# EAGLE design Obstacle+Bluetooth V1.0 (EAGLE 7.7.0)
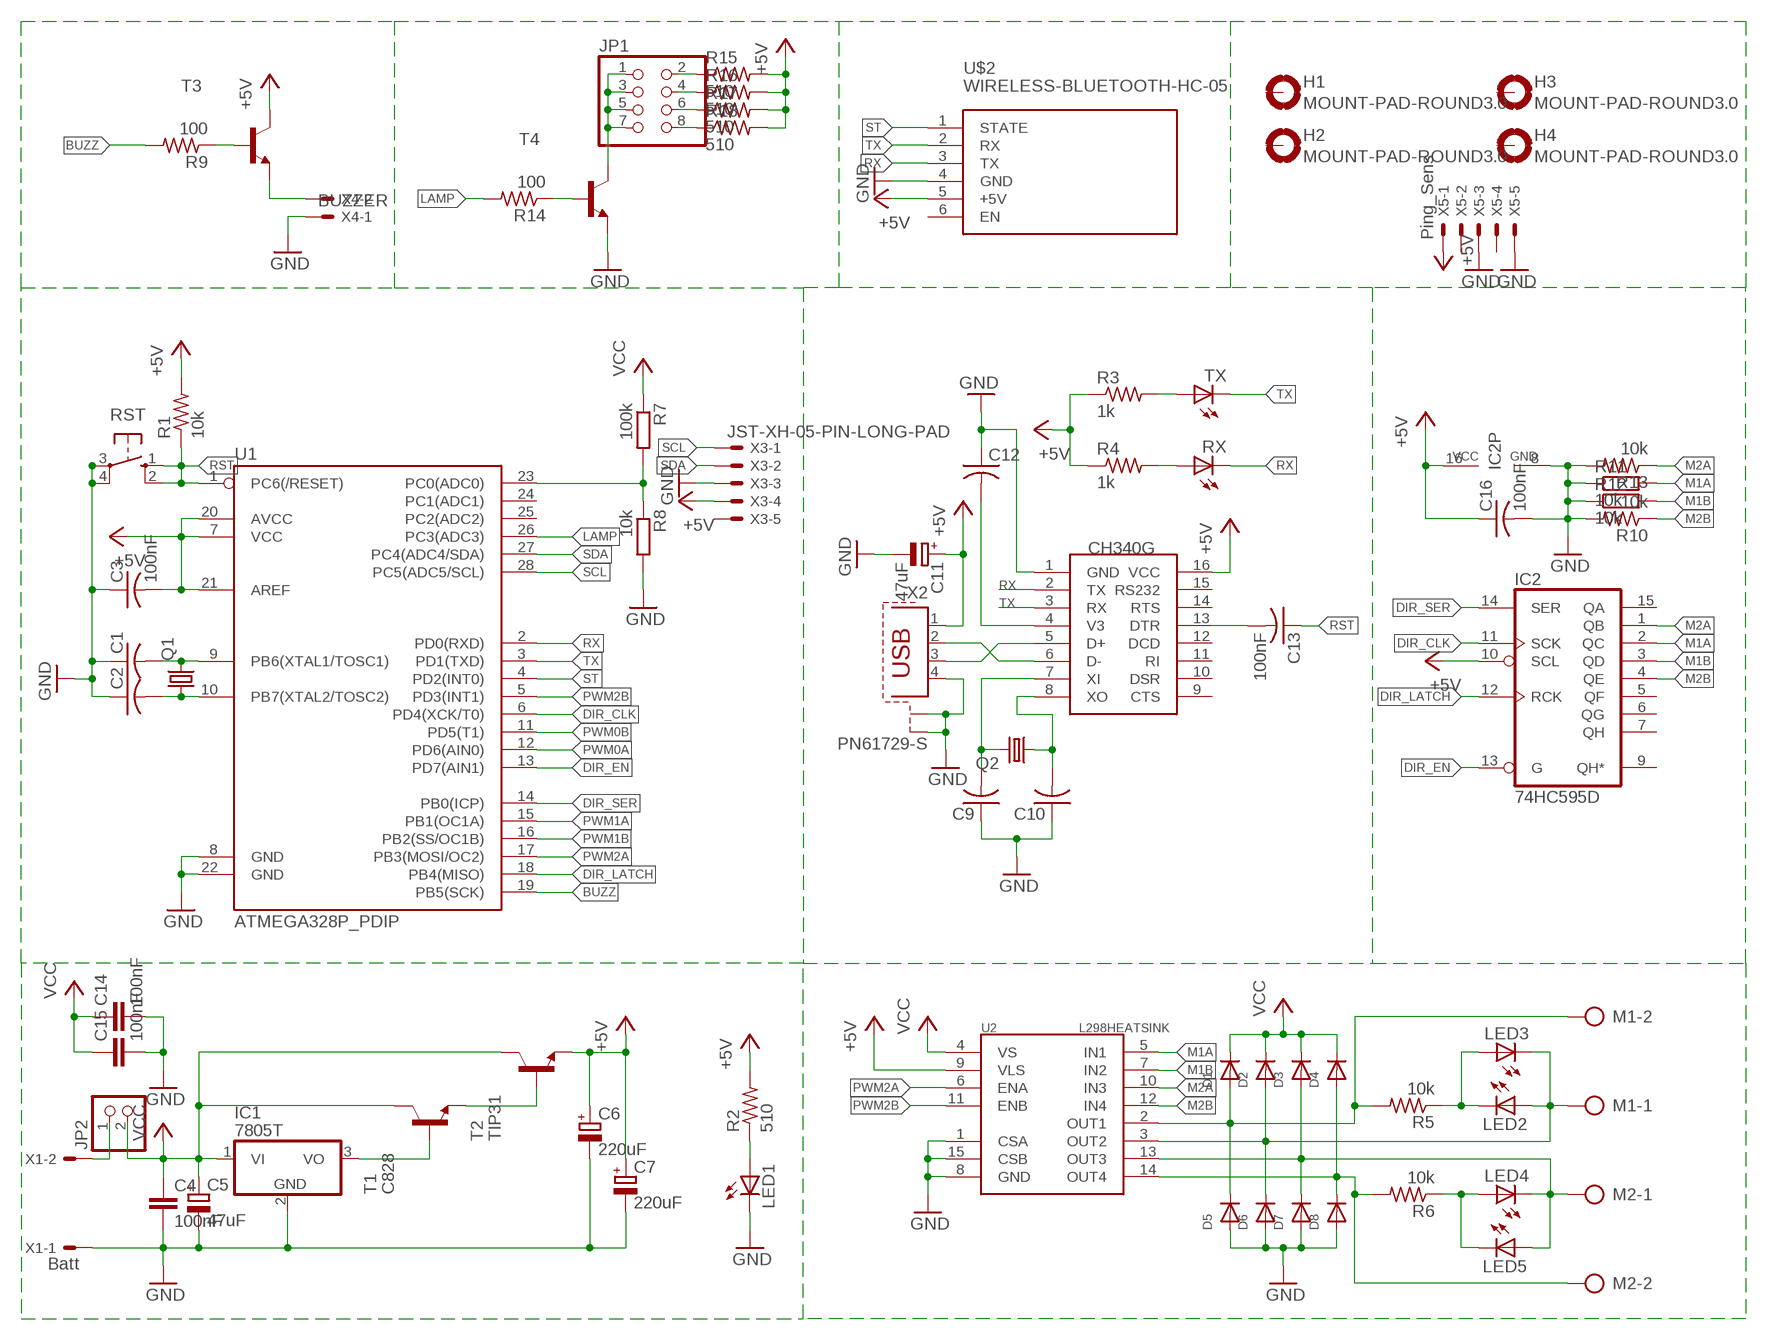
[diagram p0: schematic, sheet 1]

## Parts
C1  C-USC0603K  [C0603K]
C2  C-USC0603K  [C0603K]
C3  100nF  C-USC0603K  [C0603K]
C4  100nF  C5/2.5  [C5B2.5]
C5  47uF  CPOL-EUE2.5-7  [E2,5-7]
C6  220uF  CPOL-EUE2.5-5  [E2,5-5]
C7  220uF  CPOL-EUE2.5-5  [E2,5-5]
C9  C-USC0603K  [C0603K]
C10  C-USC0603K  [C0603K]
C11  47uF  CPOL-EUE2.5-7  [E2,5-7]
C12  C-USC0603K  [C0603K]
C13  100nF  C-USC0603K  [C0603K]
C14  100nF  C5/2.5  [C5B2.5]
C15  100nF  C5/2.5  [C5B2.5]
C16  100nF  C-USC0603K  [C0603K]
D1  DIODESMA  [SMADIODE]
D2  DIODESMA  [SMADIODE]
D3  DIODESMA  [SMADIODE]
D4  DIODESMA  [SMADIODE]
D5  DIODESMA  [SMADIODE]
D6  DIODESMA  [SMADIODE]
D7  DIODESMA  [SMADIODE]
D8  DIODESMA  [SMADIODE]
H1  MOUNT-PAD-ROUND3.0  [3,0-PAD]
H2  MOUNT-PAD-ROUND3.0  [3,0-PAD]
H3  MOUNT-PAD-ROUND3.0  [3,0-PAD]
H4  MOUNT-PAD-ROUND3.0  [3,0-PAD]
IC1  7805T  [TO220H]
IC2  74HC595D  [SO16]
JP1  PINHD-2X4  [2X04]
JP2  PINHD-1X2  [1X02]
LED1  LED3MM  [LED3MM]
LED2  LED3MM  [LED3MM]
LED3  LED3MM  [LED3MM]
LED4  LED3MM  [LED3MM]
LED5  LED3MM  [LED3MM]
M1  AK500/2  [AK500/2]
M2  AK500/2  [AK500/2]
Q1  CRYSTALHC49U-V  [HC49U-V]
Q2  CRYSTALHC49U-V  [HC49U-V]
R1  10k  R-US_R0603  [R0603]
R2  510  R-US_R0603  [R0603]
R3  1k  R-US_R0603  [R0603]
R4  1k  R-US_R0603  [R0603]
R5  10k  R-US_R0603  [R0603]
R6  10k  R-US_R0603  [R0603]
R7  100k  R-EU_0207/7  [0207/7]
R8  10k  R-EU_0207/7  [0207/7]
R9  100  R-US_R0603  [R0603]
R10  10k  R-US_R0603  [R0603]
R11  10k  R-EU_0207/7  [0207/7]
R12  10k  R-EU_0207/7  [0207/7]
R13  10k  R-US_R0603  [R0603]
R14  100  R-US_R0603  [R0603]
R15  510  R-US_R0603  [R0603]
R16  510  R-US_R0603  [R0603]
R17  510  R-US_R0603  [R0603]
R18  510  R-US_R0603  [R0603]
RST  10-XX  [B3F-10XX]
RX  LED3MM  [LED3MM]
T1  C828  2SC945  [TO92-ECB]
T2  TIP31  [TO220]
T3  -NPN-TO92L  [TO92L]
T4  -NPN-TO92L  [TO92L]
TX  LED3MM  [LED3MM]
U1  ATMEGA328P_PDIP  [DIL28-3]
U2  L298HEATSINK  [MULTIWATT15_6400BGHEATSINK]
U$1  CH340G  [SOIC16]
U$2  WIRELESS-BLUETOOTH-HC-05  [WIRELESS-BLUETOOTH-HC-05]
X1  Batt  JST-XH-02-PIN-LONG-PAD  [JST-XH-02-PACKAGE-LONG-PAD]
X2  PN61729-S  [PN61729-S]
X3  JST-XH-05-PIN-LONG-PAD  [JST-XH-05-PACKAGE-LONG-PAD]
X4  BUZZER  JST-XH-02-PIN-LONG-PAD  [JST-XH-02-PACKAGE-LONG-PAD]
X5  Ping_Sens  JST-XH-05-PIN-LONG-PAD  [JST-XH-05-PACKAGE-LONG-PAD]

## Nets
+5V: C3.2 C6.+ C7.+ C11.+ C16.1 IC2.10(SCL) IC2.16(VCC) R1.2 R2.2 R3.1 R4.1 R15.2 R16.2 R17.2 R18.2 T2.3(E) T3.3(C) U1.7(VCC) U1.20(AVCC) U1.21(AREF) U2.9(VLS) U$1.16(VCC) U$2.5(+5V) X2.1 X3.4 X5.1
BUZZ: R9.2 U1.19(PB5(SCK))
DIR_CLK: IC2.11(SCK) U1.6(PD4(XCK/T0))
DIR_EN: IC2.13(G) U1.13(PD7(AIN1))
DIR_LATCH: IC2.12(RCK) U1.18(PB4(MISO))
DIR_SER: IC2.14(SER) U1.14(PB0(ICP))
GND: C1.1 C2.1 C3.1 C4.2 C5.- C6.- C7.- C9.1 C10.1 C11.- C12.1 C14.2 C15.2 C16.2 D5.A D6.A D7.A D8.A IC1.2(GND) IC2.8(GND) LED1.K(C) R8.2 R10.2 R11.1 R12.1 R13.2 RST.3(P) RST.4(P1) T4.1(E) U1.8(GND) U1.22(GND) U2.1(CSA) U2.8(GND) U2.15(CSB) U$1.1(GND) U$2.4(GND) X1.1 X2.4 X2.S1 X2.S2 X3.3 X4.1 X5.3 X5.5
LAMP: R14.2 U1.26(PC3(ADC3))
M1A: IC2.2(QC) R11.2 U2.5(IN1)
M1B: IC2.3(QD) R12.2 U2.7(IN2)
M2A: IC2.1(QB) R13.1 U2.10(IN3)
M2B: IC2.4(QE) R10.1 U2.12(IN4)
N$1: C1.2 Q1.2 U1.9(PB6(XTAL1/TOSC1))
N$2: C2.2 Q1.1 U1.10(PB7(XTAL2/TOSC2))
N$3: C13.2 U$1.13(DTR)
N$5: R4.2 RX.A
N$6: IC1.3(VO) T1.B
N$7: T1.E T2.1(B)
N$8: R3.2 TX.A
N$9: LED1.A R2.1
N$11: U$1.6(D-) X2.2
N$12: U$1.5(D+) X2.3
N$13: C9.2 Q2.2 U$1.7(XI)
N$14: C10.2 Q2.1 U$1.8(XO)
N$15: D2.A D6.C LED2.A LED3.K(C) M1.1 U2.3(OUT2)
N$16: D3.A D7.C LED4.K(C) LED5.A M2.1 U2.13(OUT3)
N$17: C12.2 U$1.4(V3)
N$18: D4.A D8.C M2.2 R6.2 U2.14(OUT4)
N$19: LED2.K(C) LED3.A R5.1
N$20: LED4.A LED5.K(C) R6.1
N$21: R7.2 R8.1 U1.23(PC0(ADC0))
N$22: T3.1(E) X4.2
N$23: R9.1 T3.2(B)
N$24: R14.1 T4.2(B)
N$27: JP2.1 X1.2
N$28: JP1.1 JP1.3 JP1.5 JP1.7 T4.3(C)
N$29: JP1.2 R15.1
N$30: JP1.4 R16.1
N$31: JP1.6 R17.1
N$32: JP1.8 R18.1
N$34: D1.A D5.C M1.2 R5.2 U2.2(OUT1)
PWM0A: U1.12(PD6(AIN0))
PWM0B: U1.11(PD5(T1))
PWM1A: U1.15(PB1(OC1A))
PWM1B: U1.16(PB2(SS/OC1B))
PWM2A: U1.17(PB3(MOSI/OC2)) U2.6(ENA)
PWM2B: U1.5(PD3(INT1)) U2.11(ENB)
RST: C13.1 R1.1 RST.1(S) RST.2(S1) U1.1(PC6(/RESET))
RX: RX.K(C) U1.2(PD0(RXD)) U$1.2(TX) U$2.3(TX)
SCL: U1.28(PC5(ADC5/SCL)) X3.1
SDA: U1.27(PC4(ADC4/SDA)) X3.2
ST: U1.4(PD2(INT0)) U$2.1(STATE)
TX: TX.K(C) U1.3(PD1(TXD)) U$1.3(RX) U$2.2(RX)
VCC: C4.1 C5.+ C14.1 C15.1 D1.C D2.C D3.C D4.C IC1.1(VI) JP2.2 R7.1 T1.C T2.2(C) U2.4(VS)
Unconnected: H1.B3,0(MOUNT) H2.B3,0(MOUNT) H3.B3,0(MOUNT) H4.B3,0(MOUNT) IC2.5(QF) IC2.6(QG) IC2.7(QH) IC2.9(QH*) IC2.15(QA) U1.24(PC1(ADC1)) U1.25(PC2(ADC2)) U$1.9(CTS) U$1.10(DSR) U$1.11(RI) U$1.12(DCD) U$1.14(RTS) U$1.15(RS232) U$2.6(EN) X3.5 X5.2 X5.4

## Library data of the parts
C1-C3 C9 C10 C12 C13 C16 = CircuitBean:C-US: CAPACITOR, American symbol
C4 C14 C15 = capacitor-wima:C: CAPACITOR naming: grid - package width
C5-C7 C11 = resistor:CPOL-EU: POLARIZED CAPACITOR, European symbol
D1-D8 = CircuitBean:DIODE: Diode SMADIODE - SMA Surface Mount Package 20V 1A Schottky Diode Digikey: 641-1014-6-ND DO-1N4148 - Through Hole Small Current Diode SOD-123 20V 1 A (.5mV Vf) Schottky Diode - Digikey: MBRX120TPMSCT-ND SOD-323 10V 570mA (.38mV Vf, 3ns) Schottky Diode - Digikey: ZLLS410CT-ND SOD-523 30V 30mA Schottky Diode (RB751S-40TE61) - Digikey: RB751S-40TE61CT-ND SOT23-R/W - SOT23 Package (R = Solder Paste/Reflow Ovens, W = Hand-Soldering) BAT54Film 40V 300mA - Digikey: 497-7162-1-ND
H1-H4 = holes:MOUNT-PAD-ROUND: MOUNTING PAD, round
IC1 = linear:78*: Positive VOLTAGE REGULATOR Source: http://cache.national.com/ds/LM/LM78L05.pdf http://www.fairchildsemi.com/ds/LM/LM7805.pdf
IC2 = 74xx-eu:74*595: 8-bit SHIFT REGISTER, output latch
JP1 = pinhead:PINHD-2X4: PIN HEADER
JP2 = pinhead:PINHD-1X2: PIN HEADER
LED1-LED5 RX TX = CircuitBean:LED: LED OSRAM: - CHIPLED LG R971, LG N971, LY N971, LG Q971, LY Q971, LO R971, LY R971 LH N974, LH R974 LS Q976, LO Q976, LY Q976 LO Q996 - Hyper CHIPLED LW Q18S LB Q993, LB Q99A, LB R99A - SideLED LS A670, LO A670, LY A670, LG A670, LP A670 LB A673, LV A673, LT A673, LW A673 LH A674 LY A675 LS A676, LA A676, LO A676, LY A676, LW A676 LS A679, LY A679, LG A679 - Hyper Micro SIDELED® LS Y876, LA Y876, LO Y876, LY Y876 LT Y87S - SmartLED LW L88C, LW L88S LB L89C, LB L89S, LG L890 LS L89K, LO L89K, LY L89K LS L896, LA L896, LO L896, LY L896 - TOPLED LS T670, LO T670, LY T670, LG T670, LP T670 LSG T670, LSP T670, LSY T670, LOP T670, LYG T670 LG T671, LOG T671, LSG T671 LB T673, LV T673, LT T673, LW T673 LH T674 LS T676, LA T676, LO T676, LY T676, LB T676, LH T676, LSB T676, LW T676 LB T67C, LV T67C, LT T67C, LS T67K, LO T67K, LY T67K, LW E67C LS E67B, LA E67B, LO E67B, LY E67B, LB E67C, LV E67C, LT E67C LW T67C LS T679, LY T679, LG T679 LS T770, LO T770, LY T770, LG T770, LP T770 LB T773, LV T773, LT T773, LW T773 LH T774 LS E675, LA E675, LY E675, LS T675 LS T776, LA T776, LO T776, LY T776, LB T776 LHGB T686 LT T68C, LB T68C - Hyper Mini TOPLED® LB M676 - Mini TOPLED Santana® LG M470 LS M47K, LO M47K, LY M47K Source: http://www.osram.convergy.de/
M1 M2 = con-ptr500:AK500/2: CONNECTOR; OC_FARNELL: unknown; OC_NEWARK: unknown
Q1 Q2 = CircuitBean:CRYSTAL: CRYSTAL; OC_FARNELL: 1666969; OC_NEWARK: unknown
R1-R6 R9 R10 R13-R18 = CircuitBean:R-US_: RESISTOR, American symbol
R7 R8 R11 R12 = resistor:R-EU_: RESISTOR, European symbol
RST = switch-omron:10-XX: OMRON SWITCH; MPN: B3F-1000; OC_FARNELL: 176432; OC_NEWARK: 36M3542
T1 = transistor:2SC945: NPN Silicon Epitaxial Planar Transistor Source: SEMTECH ELECTRONICS LTD. ... 2SC945 2.pdf
T2 = transistor:TIP31: NPN Transistor Medium Power Linear Switching Applications Source: http://onsemi.com
T3 T4 = transistor:*-NPN-: NPN Transistror BF959 corrected 2008.03.06
U1 = SparkFun-DigitalIC:ATMEGA328P_PDIP: uC used in the Arduino 32kb flash, 1k EEPROM, 2k SRAM This is the through-hole version of this chip.
U2 = SparkFun-PowerIC:L298: L298 Dual Full Bridge Driver
U$1 = ch340g:CH340G
U$2 = diy-modules:WIRELESS-BLUETOOTH-HC-05: Bluetooth Transceiver Module based on HC-05 board Tutorial is available here: https://arduino-info.wikispaces.com/BlueTooth-HC05-HC06-Modules-How-To Click here to find device on ebay.com <http://www.ebay.com/sch/hc-05+module+rs232>
X1 X4 = JST XH Connectors v1-0:JST-XH-02-PIN: JST XH Connector 2 Pin Wire to board connector. Pitch: 2,54 mm, (0.100") Number of pins: 2 Created by Rembrandt Electronics www.rembrandtelectronics.com
X2 = con-berg:PN61729-S: BERG USB connector; OC_FARNELL: unknown; OC_NEWARK: unknown
X3 X5 = JST XH Connectors v1-0:JST-XH-05-PIN: JST XH Connector 2 Pin Wire to board connector. Pitch: 2,54 mm, (0.100") Number of pins: 5 Created by Rembrandt Electronics www.rembrandtelectronics.com

## Board
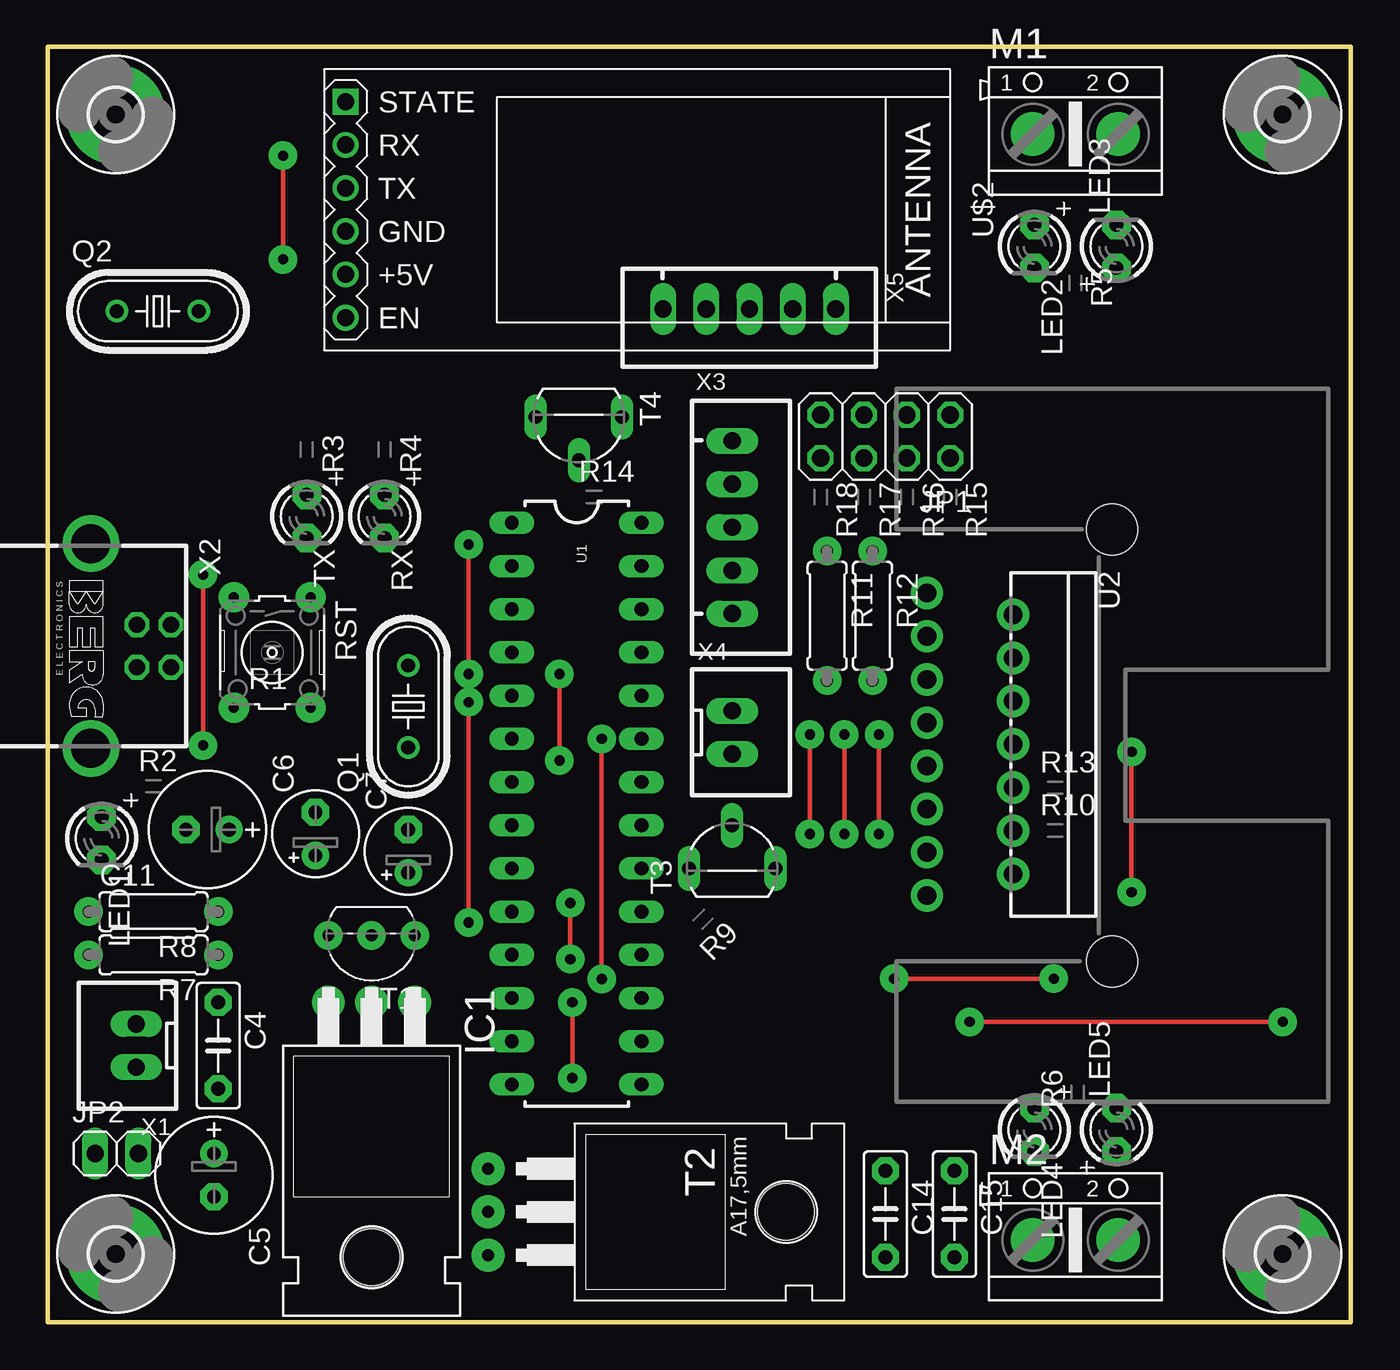
[diagram p1: board, top side]
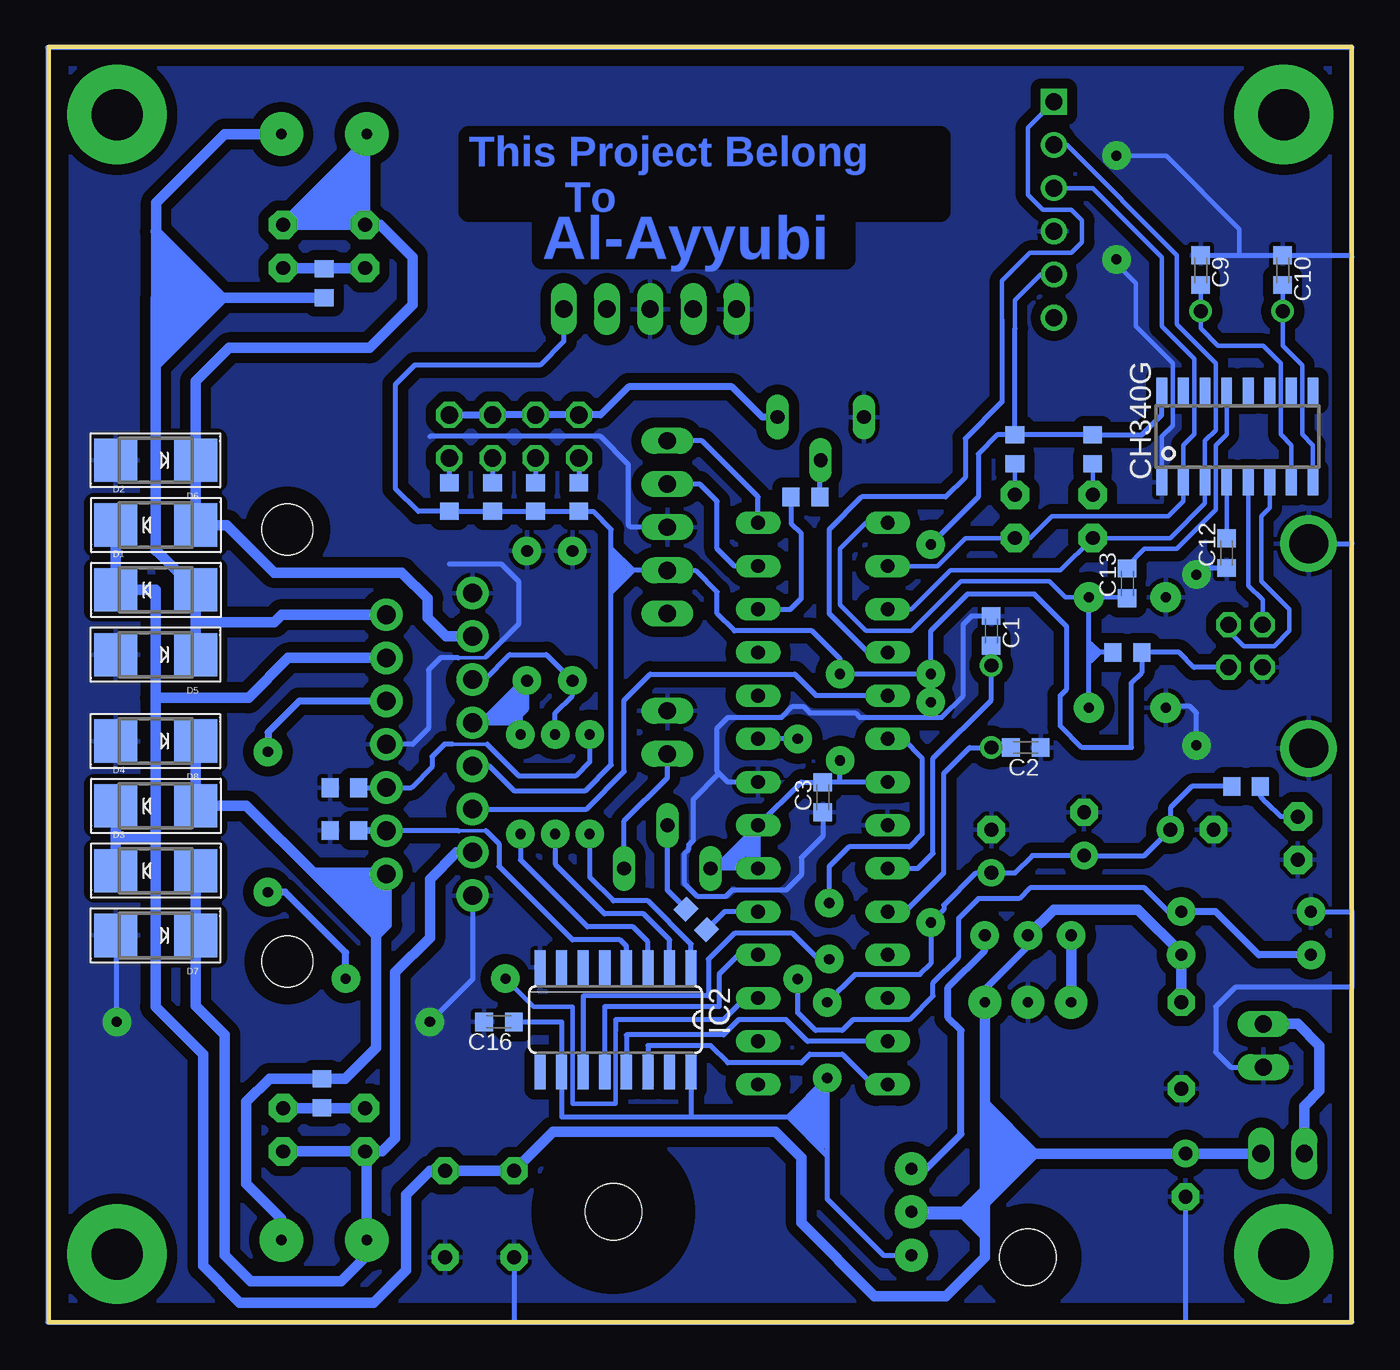
[diagram p2: board, bottom side, seen from below]

Size 76.63 x 75 mm. Coordinates in mm from the lower left corner, seen from the top.
Outline: 0,0 0,75 76.63,75 76.63,0 0,0
Copper layers (1*16): Top 0.035mm / dielectric 1.5mm / Bottom 0.035mm
Design rules "default": minimum track width 10mil, minimum drill 24mil, track to track 8mil, track to pad 8mil, pad to pad 8mil, via to via 8mil, smd to smd 8mil, copper to edge 40mil, drill to drill 8mil, minimum pad ring 10mil, minimum via ring 8mil, stop-mask expansion 4mil, vias tented up to drill 0mil, thermal gap 10mil

### Footprints (pad centres in the part's own frame; a part is rotated, then mirrored left to right if it is on the bottom)
C0603K = smd 1.05 x 1.08: 1 -0.875,0; 2 0.875,0
C5B2.5 = drill 0.813 pad 1.6 octagon: 1 -2.54,0; 2 2.54,0
E2,5-7 = drill 0.813 pad 1.6: + -1.27,0 | drill 0.813 pad 1.6 octagon: - 1.27,0
E2,5-5 = drill 0.813 pad 1.6: + -1.27,0 | drill 0.813 pad 1.6 octagon: - 1.27,0
SMADIODE = smd 2.54 x 2.54: A 2.349,0; C -2.349,0
3,0-PAD = drill 3 pad 5.842: B3,0 0,0
TO220H = drill 0.6 pad 1.93: 1 -2.54,-10.16; 2 0,-10.16; 3 2.54,-10.16 | hole 3.302: 0,4.826
SO16 = smd 0.66 x 2.032: 1 -4.445,-3.073; 2 -3.175,-3.073; 3 -1.905,-3.073; 4 -0.635,-3.073; 5 0.635,-3.073; 6 1.905,-3.073; 7 3.175,-3.073; 8 4.445,-3.073; 9 4.445,3.073; 10 3.175,3.073; 11 1.905,3.073; 12 0.635,3.073; 13 -0.635,3.073; 14 -1.905,3.073; 15 -3.175,3.073; 16 -4.445,3.073
2X04 = drill 1.016 octagon: 1 -3.81,-1.27; 2 -3.81,1.27; 3 -1.27,-1.27; 4 -1.27,1.27; 5 1.27,-1.27; 6 1.27,1.27; 7 3.81,-1.27; 8 3.81,1.27
1X02 = drill 1.016 long: 1 -1.27,0; 2 1.27,0
LED3MM = drill 0.813 pad 1.676 octagon: A -1.27,0; K 1.27,0
AK500/2 = drill 0.6 pad 2.54: 1 -2.515,0; 2 2.515,0
HC49U-V = drill 0.813: 1 -2.413,0; 2 2.413,0
R0603 = smd 1 x 1.1 bottom: 1 -0.85,0; 2 0.85,0
0207/7 = drill 0.7 pad 1.676: 1 -3.81,0; 2 3.81,0
B3F-10XX = drill 0.6 pad 1.778: 1 -3.251,2.261; 2 3.251,2.261; 3 -3.251,-2.261; 4 3.251,-2.261
TO92-ECB = drill 0.7 pad 1.676: B 2.54,0; C 0,0; E -2.54,0
TO220 = drill 0.7 pad 1.93: 1 -2.54,-6.35; 2 0,-6.35; 3 2.54,-6.35 | hole 3.302: 0,11.176
TO92L = drill 0.813 long: 1 0,-2.54; 2 2.54,0; 3 0,2.54
DIL28-3 = drill 0.813 long: 1 -16.51,-3.81; 2 -13.97,-3.81; 3 -11.43,-3.81; 4 -8.89,-3.81; 5 -6.35,-3.81; 6 -3.81,-3.81; 7 -1.27,-3.81; 8 1.27,-3.81; 9 3.81,-3.81; 10 6.35,-3.81; 11 8.89,-3.81; 12 11.43,-3.81; 13 13.97,-3.81; 14 16.51,-3.81; 15 16.51,3.81; 16 13.97,3.81; 17 11.43,3.81; 18 8.89,3.81; 19 6.35,3.81; 20 3.81,3.81; 21 1.27,3.81; 22 -1.27,3.81; 23 -3.81,3.81; 24 -6.35,3.81; 25 -8.89,3.81; 26 -11.43,3.81; 27 -13.97,3.81; 28 -16.51,3.81
MULTIWATT15_6400BGHEATSINK = drill 1.1 pad 1.9: 1 -8.95,-2.39; 2 -7.68,2.69; 3 -6.41,-2.39; 4 -5.14,2.69; 5 -3.87,-2.39; 6 -2.6,2.69; 7 -1.33,-2.39; 8 -0.06,2.69; 9 1.21,-2.39; 10 2.48,2.69; 11 3.75,-2.39; 12 5.02,2.69; 13 6.29,-2.39; 14 7.56,2.69; 15 8.83,-2.39 | hole 2.997: -12.7,8.509; 12.7,8.509
SOIC16 = smd 0.635 x 1.524: 1 -4.445,-2.695; 2 -3.175,-2.695; 3 -1.905,-2.695; 4 -0.635,-2.695; 5 0.635,-2.695; 6 1.905,-2.695; 7 3.175,-2.695; 8 4.445,-2.695; 9 4.445,2.695; 10 3.175,2.695; 11 1.905,2.695; 12 0.635,2.695; 13 -0.635,2.695; 14 -1.905,2.695; 15 -3.175,2.695; 16 -4.445,2.695
WIRELESS-BLUETOOTH-HC-05 = drill 1 square: 1 -6.35,-17.145 | drill 1: 2 -3.81,-17.145; 3 -1.27,-17.145; 4 1.27,-17.145; 5 3.81,-17.145; 6 6.35,-17.145
JST-XH-02-PACKAGE-LONG-PAD = drill 1.016 long: 1 -1.27,0; 2 1.27,0
PN61729-S = drill 0.95 octagon: 1 1.25,4.71; 2 -1.25,4.71; 3 -1.25,2.71; 4 1.25,2.71 | drill 2.3 pad 2.9: S1 -6.02,0; S2 6.02,0
JST-XH-05-PACKAGE-LONG-PAD = drill 1.016 long: 1 -5.08,0; 2 -2.54,0; 3 0,0; 4 2.54,0; 5 5.08,0

### Placement (x,y rotation side)
C1  21.21,40.64 270 bottom
C2  19.18,33.78 180 bottom
C3  31.11,30.86 90 bottom
C4  10.03,16.26 270 top
C5  9.78,8.64 270 top
C6  15.75,28.7 90 top
C7  21.21,27.69 90 top
C9  8.89,61.85 270 bottom
C10  4.06,61.85 270 bottom
C11  9.4,28.96 180 top
C12  7.37,45.21 90 bottom
C13  13.21,43.43 90 bottom
C14  49.28,6.35 270 top
C15  53.34,6.35 270 top
C16  50.16,17.65 180 bottom
D1  70.36,43.05 0 bottom
D2  70.36,46.86 0 bottom
D3  70.36,26.54 0 bottom
D4  70.36,30.35 0 bottom
D5  70.36,39.24 180 bottom
D6  70.36,50.67 180 bottom
D7  70.36,22.73 180 bottom
D8  70.36,34.16 180 bottom
H1  4,4 90 top
H2  72.63,4 90 top
H3  72.63,71 90 top
H4  4,71 90 top
IC1  19.05,8.64 180 top
IC2  43.31,17.78 180 bottom
JP1  49.28,52.07 180 top
JP2  4.06,9.91 0 top
LED1  3.17,28.45 270 top
LED2  58.04,63.25 270 top
LED3  62.87,63.25 90 top
LED4  58.04,11.3 270 top
LED5  62.87,11.3 90 top
M1  60.45,69.85 0 top
M2  60.45,4.83 0 top
Q1  21.21,36.2 90 top
Q2  6.48,59.44 0 top
R1  13.21,39.37 180 top
R2  6.22,31.5 0 top
R3  15.24,51.31 270 top
R4  19.81,51.31 270 top
R5  60.45,61.09 270 top
R6  60.58,13.46 90 top
R7  6.22,21.59 180 top
R8  6.22,24.13 180 top
R9  38.56,23.67 225 top
R10  59.26,28.91 0 top
R11  45.85,41.53 270 top
R12  48.51,41.53 270 top
R13  59.26,31.42 0 top
R14  32.13,48.51 0 top
R15  53.09,48.51 270 top
R16  50.55,48.51 270 top
R17  48.01,48.51 270 top
R18  45.47,48.51 270 top
RST  13.21,39.37 270 top
RX  19.81,47.37 270 top
T1  19.05,22.73 180 top
T2  32.26,6.48 270 top
T3  40.26,26.67 90 top
T4  31.24,53.21 270 top
TX  15.24,47.37 270 top
U1  31.11,30.48 270 top
U2  54.1,33.91 270 top
U$1  6.73,52.07 0 bottom
U$2  34.67,65.41 270 top
X1  5.21,16.26 90 top
X2  2.54,39.75 270 top
X3  40.26,46.74 270 top
X4  40.26,34.67 270 top
X5  41.27,59.56 180 top

### Tracks (layer width: path | path; a pad name or v marks a point on that pad's centre or on a via)
+5V  (via drill 0.6 pad 1.68)
  Top 0.254: v30.86,18.8 v30.86,14.35 | v24.77,45.72 v24.77,38.1 | v30.1,33.02 v30.1,38.1 | v24.77,36.45 v24.77,23.5
  Bottom 0.254: 19.81,58.42 19.81,60.07 18.29,61.59 U$2.5
  Bottom 0.305: U$1.16 11.18,53.34 12.36,52.16 R3.1 R4.1 | X2.1 9.29,38.5 10.16,39.37 R1.2 12.36,38.19 12.95,37.59 12.95,33.78 15.88,33.78 17.14,35.05 17.14,36.83 16.76,37.21 16.76,40.89 18.67,42.8 22.61,42.8 24.77,40.64 v24.77,38.1 | U1.7 30.1,31.75 | 30.1,31.75 C3.2 | C3.2 31.13,31.75 | U1.21 U1.20 T3.3 37.47,26.67 U1.21 | U1.21 32.38,31.75 31.13,31.75 | v30.86,18.8 29.21,20.45 25.4,20.45 24.77,21.08 v24.77,23.5 24,24.26 24,24.51 22.1,26.42 C7.+ 19.81,26.42 18.8,27.43 C6.+ 12.19,27.43 C11.+ 10.67,30.23 9.4,31.5 R2.2 | 30.86,14.1 30.86,12.06 | 30.86,12.06 30.86,9.78 | 30.86,9.78 30.86,7.24 27.56,3.94 T2.3 | C16.1 46.48,17.65 IC2.10 46.48,12.06 38.86,12.06 | R4.1 19.81,58.42 | R4.1 20.87,52.16 21.97,51.05 21.97,48.51 v24.77,45.72 | U2.9 50.73,32.7 49.28,31.24 45.09,31.24 43.56,32.77 43.56,42.93 | 31.13,31.75 C3.2 | 30.1,31.75 v30.1,33.02 | 42.29,44.2 X3.4 38.61,44.2 37.34,42.93 37.34,41.66 36.32,40.64 31.75,40.64 30.1,38.99 v30.1,38.1 v24.77,38.1 | 42.29,44.2 43.56,44.2 | 43.56,43.18 43.56,44.2 | 43.56,44.2 43.56,45.47 | 43.56,45.47 43.56,46.61 44.62,47.66 R18.2 R17.2 R16.2 R15.2 54.9,47.66 56.26,49.02 56.26,55.12 55.12,56.26 47.75,56.26 46.35,57.66 X5.1 | v24.77,38.1 v24.77,36.45 | 38.86,12.06 33.15,12.06 | 32.89,12.06 31.24,12.06 | 31.24,12.06 30.86,12.06 | IC2.16 38.86,12.06 | 42.29,44.2 43.56,45.47 | 42.29,44.2 43.56,42.93 | 43.56,42.93 43.56,43.18 | 43.56,43.18 42.8,43.94 42.8,44.58 43.31,45.09 43.31,43.69 | 43.31,43.56 43.31,43.69 | 43.31,43.69 42.93,44.07 42.93,44.32 43.18,44.58 | 30.86,9.78 33.15,12.06 | 33.15,12.06 32.89,12.06 | 32.89,12.06 31.11,10.29 31.11,11.43 | 31.11,11.43 31.11,11.94 32.38,11.94 31.24,10.79 31.24,11.18 31.88,11.81 31.5,11.81 31.11,11.43
  Bottom 0.305: 33.15,12.06 v30.86,14.35 30.86,14.1 | 30.86,14.1 32.77,12.19 32.51,12.19 30.99,13.72 30.99,13.46 32.26,12.19 32,12.19 30.99,13.21 30.99,12.95 31.75,12.19 31.5,12.19 30.99,12.7 30.99,12.32 31.24,12.06 | U1.21 34.92,28.96 36.96,26.92 36.58,26.92 35.05,28.45 35.05,28.19 36.45,26.8 36.07,26.8 35.05,27.81 35.05,27.56 35.81,26.8 35.43,26.8 35.05,27.18 35.05,27.05 35.31,26.8
BUZZ
  Bottom 0.305: U1.19 36.9,24.13 R9.2
DIR_CLK  (via drill 0.6 pad 1.68)
  Top 0.254: v30.73,24.64 v30.73,21.34
  Bottom 0.305: U1.6 26.42,34.29 25.27,33.15 25.27,28.7 26.04,27.94 29.59,27.94 30.73,26.8 v30.73,24.64 | v30.73,21.34 31.37,21.34 32.89,22.86 36.32,22.86 37.85,21.34 37.85,19.18 45.21,19.18 IC2.11
DIR_EN
  Bottom 0.305: U1.13 32,16.51 33.27,17.78 36.07,17.78 36.96,16.89 42.67,16.89 IC2.13
DIR_LATCH
  Bottom 0.305: U1.18 36.07,21.59 37.21,20.45 37.21,18.54 43.94,18.54 IC2.12
DIR_SER
  Bottom 0.305: IC2.14 41.4,16.26 37.72,16.26 36.7,15.24 32.38,15.24 31.88,15.75 29.97,15.75 28.19,13.97 U1.14
GND  (via drill 0.6 pad 1.68)
  Top 0.254: v9.14,43.94 v9.14,33.91 | v13.84,62.48 v13.84,68.58 | v54.23,17.65 v72.64,17.65
  Bottom 0.203: 50.93,39.12 50.95,39.12 51.02,39.05 52.54,39.05
  Bottom 0.254: U$1.1 11.18,52.07 10.54,52.7 10.54,56.39 12.7,58.55 12.7,61.09 13.84,62.23 v13.84,62.48 | v13.84,68.58 10.92,68.58 6.6,64.26 6.6,62.72
  Bottom 0.305: X2.S1 0,45.77 | 0,45.77 0,62.61 | 0,62.61 0,74.93 76.71,74.93 76.71,0 49.28,0 | 49.28,0 9.78,0 | 9.78,0 0,0 0,19.68 | 0,24.13 0,45.77 | C9.1 6.6,62.72 0.11,62.72 0,62.61 | C14.2 49.28,0 | R8.2 0,24.13 | 0,24.13 0,19.68 | 0,19.68 6.86,19.68 8,18.54 8,15.88 7.11,14.99 X1.1 | C5.- 9.78,0 | C12.1 8.75,44.34 v9.14,43.94 | v9.14,33.91 9.14,35.81 9.53,36.2 10.87,36.2 RST.4 | X3.3 42.42,46.74 42.55,46.86 42.55,50.42 44.2,52.07 54.23,52.07 | 53.09,44.58 50.04,44.58 49.02,43.56 49.02,41.02 50.93,39.12 | 52.54,39.05 53.6,39.05 54.3,38.35 54.3,34.91 55.24,33.97 U2.8 | U2.15 51.71,20.17 v54.23,17.65 | v72.64,17.65 72.64,22.67 D7.A | U1.22 36.7,31.75 37.21,32.26 | 37.21,32.26 37.34,32.38 37.34,34.92 36.7,35.56 33.53,35.56 32.89,36.2 32.26,36.2 31.88,35.81 29.21,35.81 28.96,35.56 24.13,35.56 22.86,36.83 22.86,41.02 22.35,41.53 21.22,41.53 C1.1 | C3.1 31.11,28.57 32.38,27.3 32.38,26.29 33.27,25.4 36.45,25.4 36.83,25.02 38.48,25.02 39.24,25.78 39.24,27.56 38.99,27.81 38.99,28.07 38.73,28.32 38.73,30.73 37.21,32.26
  pour Bottom (isolate 0.61): 0,0 76.58,0 76.58,74.93 0,74.93
LAMP
  Bottom 0.305: U1.26 33.02,41.91 32.38,42.55 32.38,46.35 32.98,46.95 R14.2
M1A  (via drill 0.6 pad 1.68)
  Top 0.254: v46.86,28.7 v46.86,34.54
  Bottom 0.305: U2.5 50.99,37.78 49.53,39.24 47.37,39.24 R11.2 45.85,36.83 46.86,35.81 v46.86,34.54 | IC2.2 40.13,22.48 41.66,24 43.94,24 46.86,26.92 v46.86,28.7
M1B  (via drill 0.6 pad 1.68)
  Top 0.254: v48.9,28.7 v48.9,34.54
  Bottom 0.305: IC2.3 41.4,22.35 42.29,23.24 44.96,23.24 48.9,27.18 v48.9,28.7 | v48.9,34.54 48.9,35.18 | 48.9,35.18 48.9,35.69 48.51,36.07 R12.2 48.77,37.72 51.18,35.31 50.93,35.31 48.77,37.47 48.77,37.34 50.67,35.43 50.42,35.43 48.64,37.21 48.64,36.96 50.16,35.43 49.91,35.43 48.77,36.58 48.77,36.32 49.66,35.43 49.4,35.43 48.64,36.2 48.64,35.94 49.15,35.43 | U2.7 48.95,35.24 48.9,35.18
M2A  (via drill 0.6 pad 1.68)
  Top 0.254: v44.83,28.7 v44.83,34.54
  Bottom 0.203: 50.85,33.98 52.91,33.98
  Bottom 0.305: IC2.1 38.86,22.23 41.4,24.77 43.43,24.77 44.83,26.16 v44.83,28.7 | R13.1 56.8,31.42 U2.10 55.31,31.43 54.1,32.64 54.1,33.25 53.37,33.98 52.91,33.98 | v44.83,34.54 44.83,32.94 45.67,32.11 49,32.11 49,32.13 50.85,33.98
M2B
  Bottom 0.203: 50.94,28.89 52.53,28.89
  Bottom 0.305: IC2.4 42.67,22.1 43.05,22.48 45.85,22.48 50.16,26.8 50.16,28.12 50.94,28.89 | 52.53,28.89 U2.12
  Bottom 0.406: U2.12 58.39,28.89 R10.1
N$1
  Bottom 0.305: U1.9 25.53,26.67 24.64,27.56 24.64,33.15 21.21,36.58 Q1.2 C1.2
N$2
  Bottom 0.305: U1.10 26.29,24.13 24,26.42 24,32.26 22.48,33.78 Q1.1 C2.2
N$3
  Bottom 0.254: C13.2 13.21,44.45 12.19,45.47 10.29,45.47 8,47.75 8,51.56 7.37,52.2 U$1.13
N$5
  Bottom 0.254: RX.A R4.2
N$6
  Bottom 0.61: T1.B IC1.3
N$7
  Bottom 0.406: T2.1 25.02,9.02 22.99,11.05 22.99,17.14 23.75,17.91 23.75,19.68 21.59,21.84 T1.E
N$8
  Bottom 0.254: TX.A R3.2
N$9
  Bottom 0.305: LED1.A 4.19,29.72 5.02,30.54 5.33,30.86 5.37,30.9 R2.1
N$10
  pour Bottom (isolate 0.61): 0,0 76.58,0 76.58,74.93 0,74.93
N$11
  Bottom 0.254: X2.2 7.25,40.65 6.35,39.75 4.57,39.75 3.68,40.64 3.68,41.91 5.33,43.56 5.33,47.37 4.83,47.88 U$1.6
N$12
  Bottom 0.254: X2.3 5.25,42.46 6.1,43.31 U$1.5
N$13
  Bottom 0.254: U$1.7 3.56,51.56 4.19,52.2 4.19,56.39 5.21,57.4 7.87,57.4 8.89,58.42 Q2.2 C9.2
N$14
  Bottom 0.254: U$1.8 2.29,51.56 2.92,52.2 2.92,56.26 4.06,57.4 Q2.1 C10.2
N$15
  Bottom 0.61: D2.A D6.C | LED2.A LED3.K | M1.1 58.04,69.85 LED2.A | LED2.A 57.15,64.52 55.24,62.61 55.24,59.82 57.78,57.28 66.04,57.28 68.01,55.31 D2.A | 57.91,69.85 57.91,69.47 LED3.K | LED3.K 62.23,64.52 58.42,68.33 58.42,67.69 61.34,64.77 60.83,64.77 58.42,67.18 58.42,66.67 60.33,64.77 59.56,64.77 58.29,66.04 58.29,65.41 59.05,64.64 58.42,64.64 58.17,64.9 | U2.3 53.27,40.32 54.36,41.4 54.36,42.55 55.88,44.07 63.37,44.07 66.17,46.86 D2.A
N$16
  Bottom 0.61: D3.A D7.C 68.01,18.61 66.29,16.89 66.29,3.94 64.77,2.41 59.44,2.41 57.91,3.94 57.91,4.8 M2.1 57.94,9.93 LED4.K | LED5.A LED4.K | LED4.K 57.02,10.03 56.26,10.79 56.26,20.57 54.23,22.61 54.23,26.04 52.65,27.62 U2.13
N$17
  Bottom 0.254: C12.2 U$1.4
N$18
  Bottom 0.61: D8.C D4.A 65.02,30.35 60.96,26.29 | M2.2 62.97,6.07 65.02,8.13 65.02,12.95 63.67,14.31 R6.2 59.22,14.31 57.4,16.13 57.4,22.73 | 57.4,22.73 56.77,23.37 56.77,26.33 U2.14 | 57.4,22.73 60.96,26.29 | 60.96,26.29 60.33,26.29 57.4,23.37 57.4,25.78 57.28,25.91 57.28,23.5 57.15,23.37 57.15,23.5 59.69,26.04 59.18,26.04 | 58.17,26.04 57.78,26.04 57.66,25.91 57.66,24.51 | 57.66,24.13 57.66,24.51 | 57.66,24.51 59.18,26.04 | 59.18,26.04 58.55,26.04 | 58.55,26.04 58.17,26.04 | 58.17,26.04 57.91,25.78 57.91,25.4 | 57.91,24.38 57.91,25.4 | 57.91,25.4 58.55,26.04
N$19
  Bottom 0.61: LED2.K 60.41,61.98 R5.1 60.49,61.98 LED3.A
N$20
  Bottom 0.61: LED4.A 60.54,12.57 R6.1 60.62,12.57 LED5.K
N$21  (via drill 0.6 pad 1.68)
  Top 0.254: v32.59,20.17 v32.59,34.29
  Bottom 0.305: v32.59,20.17 32.59,18.19 31.55,17.14 29.97,17.14 29.34,17.78 26.04,17.78 24.64,19.18 24.64,19.94 23.11,21.46 23.11,23.75 21.97,24.89 19.56,24.89 18.92,25.53 12.19,25.53 10.79,24.13 R8.1 | v32.59,34.29 U1.23
  Bottom 0.406: R7.2 5.46,21.59 8,24.13 R8.1
N$22
  Bottom 0.305: T3.1 42.8,29.46 40.26,32 X4.2
N$23
  Bottom 0.305: R9.1 39.08,24.22 40.26,25.4 T3.2
N$24
  Bottom 0.305: R14.1 31.28,50.63 T4.2
N$27
  Bottom 0.61: JP2.1 2.79,12.7 1.91,13.59 1.91,16.26 3.17,17.53 X1.2
N$28
  Bottom 0.406: T4.3 34.67,53.21 36.45,54.99 42.55,54.99 44.2,53.34 JP1.7 JP1.5 JP1.3 JP1.1
N$29
  Bottom 0.305: JP1.2 R15.1
N$30
  Bottom 0.305: JP1.4 R16.1
N$31
  Bottom 0.305: JP1.6 R17.1
N$32
  Bottom 0.305: JP1.8 R18.1
N$33
  Bottom 0.61: 21.21,7.75 21.21,11.81 19.68,10.29 19.68,9.4 20.83,8.26 20.83,9.02 | 20.83,9.02 20.83,10.79 | 20.83,10.92 20.83,10.79 | 20.83,10.79 20.07,10.03 20.07,9.78 20.83,9.02
N$34
  Bottom 0.61: 70.36,64.14 66.42,60.2 70.36,56.26 | D5.C 68.01,41.15 | 68.01,41.15 D1.A 70.29,45.34 70.36,45.34 70.36,56.26 | 70.36,56.9 70.36,60.2 70.32,60.24 | R5.2 70.32,60.24 | U2.2 62.93,41.59 63.37,41.15 68.01,41.15 | M1.2 66.29,69.85 70.32,65.83 70.32,60.24 | 70.36,56.26 70.36,56.9 | 70.36,56.9 67.31,59.94 67.31,60.58 69.98,63.25 69.98,57.78 69.85,57.78 67.69,59.94 67.69,60.45 69.6,62.36 69.6,58.67 | 69.6,58.29 69.6,58.67 | 69.6,58.67 69.09,59.18 | 69.09,59.18 68.33,59.94 68.33,60.58 69.47,61.72 69.47,59.56 69.09,59.18 | 69.09,59.18 69.09,59.56 | 69.09,59.56 69.09,60.83 | 69.09,60.96 69.09,60.83 | 69.09,60.83 68.45,60.2 69.09,59.56
N$35
  Bottom 0.61: 60.83,26.42 56.77,26.42
PWM2A  (via drill 0.6 pad 1.68)
  Top 0.254: v49.78,20.19 v59.18,20.19 | v63.75,25.27 v63.75,33.53
  Bottom 0.254: 43.31,17.14 43.31,12.83 45.85,12.83 45.85,18.54 48.13,18.54 v49.78,20.19
  Bottom 0.305: U1.17 35.69,19.05 36.96,17.78 43.31,17.78 43.31,17.14
  Bottom 0.406: v59.18,20.19 59.18,21.72 62.74,25.27 v63.75,25.27 | U2.6 61.92,36.51 63.75,34.67 v63.75,33.53
PWM2B
  Bottom 0.305: U1.5 31.5,36.83 32.77,38.1 41.27,38.1 42.8,36.58 42.8,32.38 45.02,30.16 U2.11
RST
  Bottom 0.254: C13.1 13.27,42.62 RST.1 16.84,42.62 17.78,43.56 22.99,43.56 25.91,40.64 28.57,40.64 30.1,42.16 30.1,45.47 28.57,46.99 U1.1
  Bottom 0.305: RST.2 15.47,39.37 | 15.47,39.37 RST.1 | R1.1 14.86,39.37 | 14.86,39.37 15.47,39.37 | 14.86,39.37 15.37,39.88 | 14.86,39.37 15.37,38.86 15.37,39.12 15.24,39.24 15.24,39.5
RX
  Bottom 0.254: U1.2 24.38,44.45 22.73,46.1 RX.K 18.92,46.1 17.65,47.37 10.79,47.37 9.91,48.26 U$1.2 9.91,51.56 9.27,52.2 9.27,56.64 11.18,58.55 11.18,62.61 15.24,66.67 U$2.3
SCL
  Bottom 0.305: U1.28 34.92,48.51 38.23,51.82 X3.1
SDA
  Bottom 0.305: U1.27 36.32,44.45 37.34,45.47 37.34,48.26 38.35,49.28 X3.2
ST
  Bottom 0.254: 20.57,58.93 20.57,61.21 18.92,62.87 16.51,62.87 15.88,63.5 15.88,64.77 16.51,65.41 18.16,65.41 19.05,66.29 19.05,70.23 U$2.1
  Bottom 0.305: 20.57,58.93 20.57,54.1 22.73,51.94 22.73,49.66 23.88,48.51 28.83,48.51 30.73,46.61 30.73,41.66 28.45,39.37 U1.4
TX
  Bottom 0.254: U1.3 25.91,41.91 23.62,44.2 17.14,44.2 TX.K 10.67,46.1 8.64,48.13 U$1.3 8.64,51.82 8,52.45 8,56.39 10.29,58.67 10.29,62.74 16.76,69.22 U$2.2
VCC
  Bottom 0.406: IC1.1 21.59,19.56 19.05,22.1 T1.C
  Bottom 0.61: JP2.2 C5.+ 18.67,9.91 | R7.1 C4.1 10.03,21.72 12.57,24.26 17.53,24.26 T1.C | 18.67,9.91 21.59,9.91 | 21.59,9.91 21.59,12.83 | 21.59,12.83 IC1.1 | 21.59,9.91 21.59,7.75 | 21.59,6.99 21.59,6.48 | 21.59,6.48 21.59,5.59 | 21.59,5.08 21.59,3.81 23.88,1.52 28.07,1.52 32.38,5.84 32.38,9.65 33.91,11.18 46.99,11.18 C14.1 C15.1 54.23,8.89 55.63,7.49 55.63,3.05 57.53,1.14 65.41,1.14 67.56,3.3 67.56,15.75 70.36,18.54 70.36,28.45 | 21.59,6.48 T2.2 25.02,6.48 | D2.C D1.C 70.36,43.05 70.36,36.7 | D4.C D3.C 72.71,28.38 72.64,28.45 70.36,28.45 | D4.C 72.71,30.8 72.64,30.86 72.64,30.42 D4.C | 70.36,36.7 70.36,28.45 | U2.4 62.55,39.05 64.9,36.7 70.36,36.7 | 18.67,9.91 21.59,12.83 | 18.67,9.91 21.59,6.99 | 26.16,6.35 22.99,6.35 | 22.99,6.35 22.86,6.35 21.59,5.08 | 21.59,5.08 21.59,5.59 | 21.59,5.59 22.23,6.22 | 22.99,6.35 21.59,7.75 | 21.59,7.75 21.59,6.99 | 21.59,6.99 21.97,6.6

### Text on the board
Bottom: This Project Belong / To | Al-Ayyubi